# EAGLE design LB1. Expansion Board (EAGLE 9.6.2)
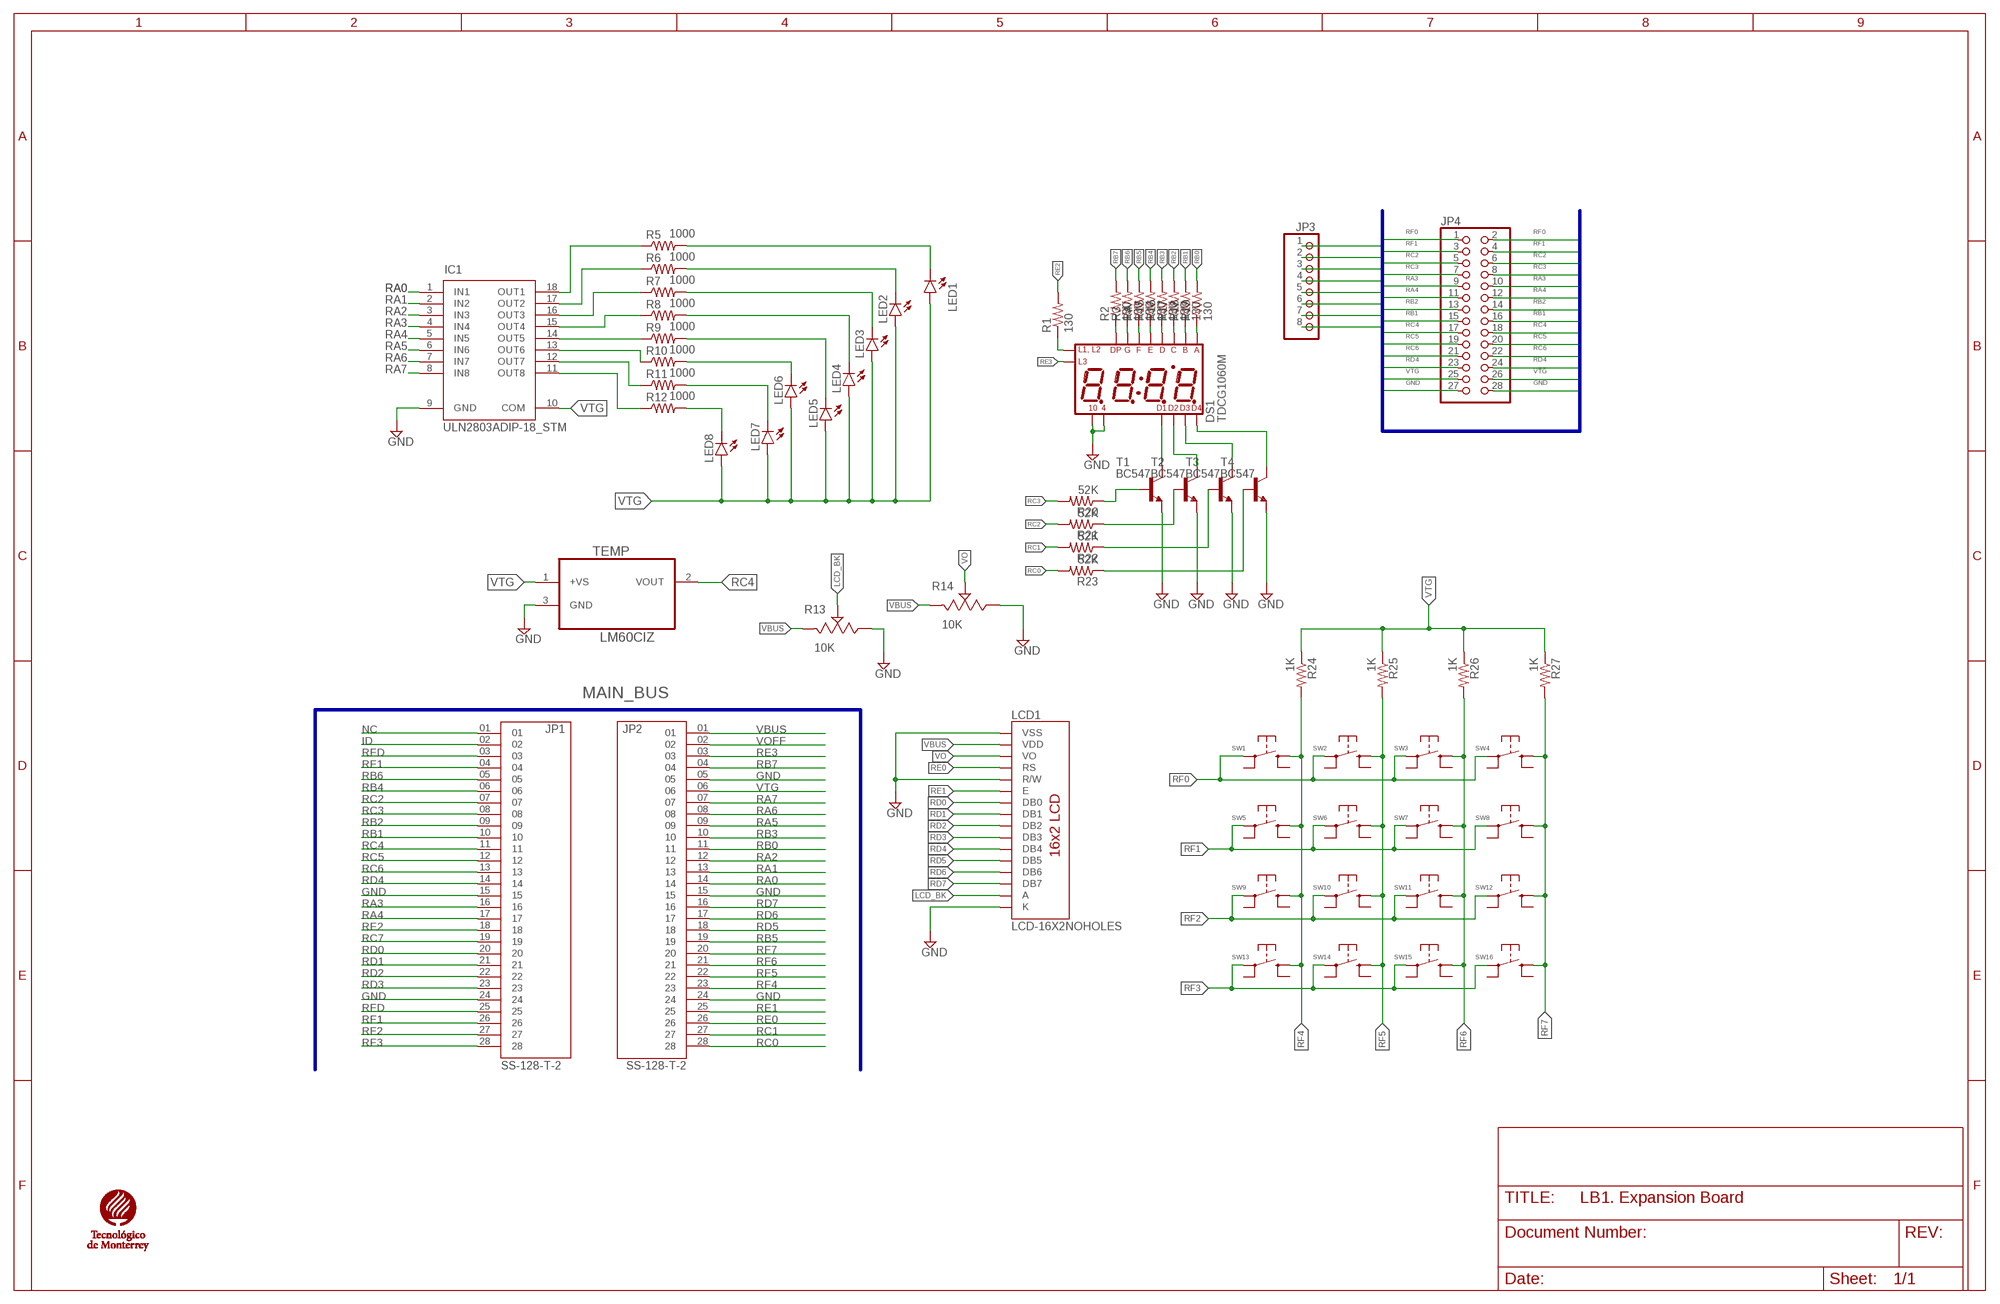
[diagram p0: schematic, sheet 1]

## Parts
DS1  TDCG1060M  [DISPLAY_TDCG1060M]
IC1  ULN2803ADIP-18_STM  [DIP-18_STM]
JP1  SS-128-T-2  [SAMTEC_SS-128-T-2]
JP2  SS-128-T-2  [SAMTEC_SS-128-T-2]
JP3  PINHD-1X8BIG  [1X08-BIG]
JP4  PINHD-2X14-CB  [2X14-BIG]
LCD1  LCD-16X2NOHOLES  [LCD-16X2_NOHOLESNOSILK]
LED1  LED3MM  [LED3MM]
LED2  LED3MM  [LED3MM]
LED3  LED3MM  [LED3MM]
LED4  LED3MM  [LED3MM]
LED5  LED3MM  [LED3MM]
LED6  LED3MM  [LED3MM]
LED7  LED3MM  [LED3MM]
LED8  LED3MM  [LED3MM]
R1  130  R-US  [0207/10]
R2  130  R-US  [0207/10]
R3  130  R-US  [0207/10]
R4  130  R-US  [0207/10]
R5  1000  R-US  [0207/10]
R6  1000  R-US  [0207/10]
R7  1000  R-US  [0207/10]
R8  1000  R-US  [0207/10]
R9  1000  R-US  [0207/10]
R10  1000  R-US  [0207/10]
R11  1000  R-US  [0207/10]
R12  1000  R-US  [0207/10]
R13  10K  3362P-1-103LF  [3362P-1-103LF]
R14  10K  3362P-1-103LF  [3362P-1-103LF]
R15  130  R-US  [0207/10]
R16  130  R-US  [0207/10]
R17  130  R-US  [0207/10]
R18  130  R-US  [0207/10]
R19  130  R-US  [0207/10]
R20  52K  R-US  [0207/10]
R21  52K  R-US  [0207/10]
R22  52K  R-US  [0207/10]
R23  52K  R-US  [0207/10]
R24  1K  R-US  [0207/10]
R25  1K  R-US  [0207/10]
R26  1K  R-US  [0207/10]
R27  1K  R-US  [0207/10]
SW1  1825910-2  [TE_1825910-2]
SW2  1825910-2  [TE_1825910-2]
SW3  1825910-2  [TE_1825910-2]
SW4  1825910-2  [TE_1825910-2]
SW5  1825910-2  [TE_1825910-2]
SW6  1825910-2  [TE_1825910-2]
SW7  1825910-2  [TE_1825910-2]
SW8  1825910-2  [TE_1825910-2]
SW9  1825910-2  [TE_1825910-2]
SW10  1825910-2  [TE_1825910-2]
SW11  1825910-2  [TE_1825910-2]
SW12  1825910-2  [TE_1825910-2]
SW13  1825910-2  [TE_1825910-2]
SW14  1825910-2  [TE_1825910-2]
SW15  1825910-2  [TE_1825910-2]
SW16  1825910-2  [TE_1825910-2]
T1  BC547  [TO92]
T2  BC547  [TO92]
T3  BC547  [TO92]
T4  BC547  [TO92]
TEC1  TEC_LOGO  [TEC_LOGO]
TEMP  LM60CIZ  [TO92/]

## Nets
GND: DS1.4 DS1.10 IC1.9(GND) JP1.15 JP1.24 JP2.05 JP2.15 JP2.24 JP3.1 JP4.27 JP4.28 LCD1.1(VSS) LCD1.5(R/W) LCD1.16(K) R13.3 R14.3 T1.1(E) T2.1(E) T3.1(E) T4.1(E) TEMP.3(GND)
ID: JP1.02
LCD_BK: LCD1.15(A) R13.2
N$1: LED1.K(C) R5.2
N$2: IC1.18(OUT1) R5.1
N$3: IC1.17(OUT2) R6.1
N$4: LED2.K(C) R6.2
N$5: IC1.16(OUT3) R7.1
N$6: IC1.15(OUT4) R8.1
N$7: IC1.14(OUT5) R9.1
N$8: IC1.13(OUT6) R10.1
N$9: IC1.12(OUT7) R11.1
N$10: IC1.11(OUT8) R12.1
N$11: LED3.K(C) R7.2
N$12: LED4.K(C) R8.2
N$13: LED5.K(C) R9.2
N$14: LED6.K(C) R10.2
N$15: LED8.K(C) R12.2
N$16: LED7.K(C) R11.2
N$17: R20.1 T1.2(B)
N$18: LED1.A LED2.A LED3.A LED4.A LED5.A LED6.A LED7.A LED8.A
N$19: DS1.12(L1_L2) R1.1
N$20: DS1.7(DP) R2.1
N$21: DS1.15(G) R3.1
N$22: DS1.11(F) R4.1
N$23: DS1.5(E) R15.1
N$24: DS1.3(D) R16.1
N$25: DS1.13(C) R17.1
N$26: DS1.16(B) R18.1
N$27: DS1.14(A) R19.1
N$28: R21.1 T2.2(B)
N$29: R22.1 T3.2(B)
N$30: R23.1 T4.2(B)
N$31: DS1.1(DIG1) T1.3(C)
N$32: DS1.2(DIG2) T2.3(C)
N$33: DS1.6(DIG3) T3.3(C)
N$34: DS1.8(DIG4) T4.3(C)
NC: JP1.01
RA0: IC1.1(IN1) JP2.14
RA1: IC1.2(IN2) JP2.13
RA2: IC1.3(IN3) JP2.12
RA3: IC1.4(IN4) JP1.16 JP3.2 JP4.9 JP4.10
RA4: IC1.5(IN5) JP1.17 JP3.3 JP4.11 JP4.12
RA5: IC1.6(IN6) JP2.09
RA6: IC1.7(IN7) JP2.08
RA7: IC1.8(IN8) JP2.07
RB0: JP2.11 R19.2
RB1: JP1.10 JP3.4 JP4.15 JP4.16 R18.2
RB2: JP1.09 JP3.5 JP4.13 JP4.14 R17.2
RB3: JP2.10 R16.2
RB4: JP1.06 R15.2
RB5: JP2.19 R4.2
RB6: JP1.05 R3.2
RB7: JP2.04 R2.2
RC0: JP2.28 R23.2
RC1: JP2.27 R22.2
RC2: JP1.07 JP3.6 JP4.5 JP4.6 R21.2
RC3: JP1.08 JP3.7 JP4.7 JP4.8 R20.2
RC4: JP1.11 JP3.8 JP4.17 JP4.18 TEMP.2(VOUT)
RC5: JP1.12 JP4.19 JP4.20
RC6: JP1.13 JP4.21 JP4.22
RC7: JP1.19
RD0: JP1.20 LCD1.7(DB0)
RD1: JP1.21 LCD1.8(DB1)
RD2: JP1.22 LCD1.9(DB2)
RD3: JP1.23 LCD1.10(DB3)
RD4: JP1.14 JP4.23 JP4.24 LCD1.11(DB4)
RD5: JP2.18 LCD1.12(DB5)
RD6: JP2.17 LCD1.13(DB6)
RD7: JP2.16 LCD1.14(DB7)
RE0: JP2.26 LCD1.4(RS)
RE1: JP2.25 LCD1.6(E)
RE2: JP1.18 R1.2
RE3: DS1.9(L3) JP2.03
RF0: JP4.1 JP4.2 SW1.1(P) SW2.1(P) SW3.1(P) SW4.1(P)
RF1: JP1.04 JP1.26 JP4.3 JP4.4 SW5.1(P) SW6.1(P) SW7.1(P) SW8.1(P)
RF2: JP1.27 SW9.1(P) SW10.1(P) SW11.1(P) SW12.1(P)
RF3: JP1.28 SW13.1(P) SW14.1(P) SW15.1(P) SW16.1(P)
RF4: JP2.23 R24.2 SW1.2(S) SW5.2(S) SW9.2(S) SW13.2(S)
RF5: JP2.22 R25.2 SW2.2(S) SW6.2(S) SW10.2(S) SW14.2(S)
RF6: JP2.21 R26.2 SW3.2(S) SW7.2(S) SW11.2(S) SW15.2(S)
RF7: JP2.20 R27.2 SW4.2(S) SW8.2(S) SW12.2(S) SW16.2(S)
RFD: JP1.03 JP1.25
VBUS: JP2.01 LCD1.2(VDD) R13.1 R14.1
VO: LCD1.3(VO) R14.2
VOFF: JP2.02
VTG: IC1.10(COM) JP2.06 JP4.25 JP4.26 R24.1 R25.1 R26.1 R27.1 TEMP.1(+VS)
Unconnected: SW1.3(P1) SW1.4(S1) SW2.3(P1) SW2.4(S1) SW3.3(P1) SW3.4(S1) SW4.3(P1) SW4.4(S1) SW5.3(P1) SW5.4(S1) SW6.3(P1) SW6.4(S1) SW7.3(P1) SW7.4(S1) SW8.3(P1) SW8.4(S1) SW9.3(P1) SW9.4(S1) SW10.3(P1) SW10.4(S1) SW11.3(P1) SW11.4(S1) SW12.3(P1) SW12.4(S1) SW13.3(P1) SW13.4(S1) SW14.3(P1) SW14.4(S1) SW15.3(P1) SW15.4(S1) SW16.3(P1) SW16.4(S1)

## Buses
GND,RA3,RA4,RB1,RB2,RC2,RC3,RC4,RC5,RC6,RD4,RF0,RF1,VTG
MAIN_BUS

## Library data of the parts
DS1 = TE2015_Microcontroladores:TDCG1060M: Clockmodule 10mm Green m.Plex c.c.-E4; DESCRIPTION: Display Modules - LED Character and Numeric Green 7-Segment Clock 4 Character Common Cathode 2V 20mA 0.504 H x 1.583 W x 0.276 D (12.80mm x 40.20mm x 7.00mm) 16-DIP (0.400, 10.16mm); DIGI-KEY_PART_NUMBER: TDCG1060M-ND; MF: Vishay; MP: TDCG1060M; PACKAGE: None; PURCHASE-URL: https://pricing.snapeda.com/search/part/TDCG1060M/?ref=eda
IC1 = TE2015_Microcontroladores:ULN2803A; COPYRIGHT: Copyright (C) 2022 Ultra Librarian. All rights reserved.; DIGI-KEY_PART_NUMBER_1: 497-2356-5-ND; MANUFACTURER_PART_NUMBER: ULN2803A; MFR_NAME: STMicroelectronics
JP1 JP2 = TE2015_Microcontroladores:SS-128-T-2; DESCRIPTION: 28 Position Receptacle Connector 0.100 (2.54mm) Through Hole Gold; DIGI-KEY_PART_NUMBER: SAM1117-28-ND; MF: Samtec; MP: SS-128-T-2; PACKAGE: None; PURCHASE-URL: https://pricing.snapeda.com/search/part/SS-128-T-2/?ref=eda
JP3 = TE2015_Microcontroladores:PINHD-1X8: PIN HEADER
JP4 = TE2015_Microcontroladores:PINHD-2X14: PIN HEADER
LCD1 = TE2015_Microcontroladores:LCD-16X2: Standard text-only 16x2 parallel input LCD Basic 16 character by 2 line display. Typically utilizes the extremely common HD44780 parallel interface chipset SparkFun Products: Basic 16x2 Green <https://www.sparkfun.com/products/255> Basic 8x2 Green <https://www.sparkfun.com/products/11122>; SF_ID: LCD-00255
LED1-LED8 = TE2015_Microcontroladores:LED3MM
R1-R12 R15-R27 = TE2015_Microcontroladores:R-US; SPICEPREFIX: R
R13 R14 = TE2015_Microcontroladores:3362P-1-103LF: TRIMMER 10K OHM 0.5W PC PIN TOP Manufacturer's datasheet <https://www.bourns.com/docs/Product-Datasheets/3362.pdf>; CREATED_PN: PCBLayout.com; DIGIKEY_PN: 3362P-103LF-ND; MANUFACTURER: Bourns Inc.; MPN: 3362P-1-103LF
SW1-SW16 = TE2015_Microcontroladores:1825910-2: SWITCH TACTILE SPST-NO 0.05A 24V Check availability <https://pricing.snapeda.com/parts/1825910-2/TE%20Connectivity/view-part?ref=eda>; AVAILABILITY: In Stock; COMMENT: 1825910-2; CONFIGURATION_POLE-THROW: Single Pole - Single Throw; CONTACT_CURRENT_RATING: 50 mA; DESCRIPTION: 50 mA SPST Round Actuator 160 Gram Force Tactile Pushbutton Switch; EU_ROHS_COMPLIANCE: Compliant; MF: TE Connectivity; MP: 1825910-2; PACKAGE: None; PRICE: None; PURCHASE-URL: https://pricing.snapeda.com/search/part/1825910-2/?ref=eda
T1-T4 = transistor:BC547: NPN TRANSISTOR
TEC1 = TE2015_Microcontroladores:TEC_LOGO
TEMP = TE2015_Microcontroladores:LM60CIZ: IC, TEMPERATURE SENSOR, ± 3°C

## Board
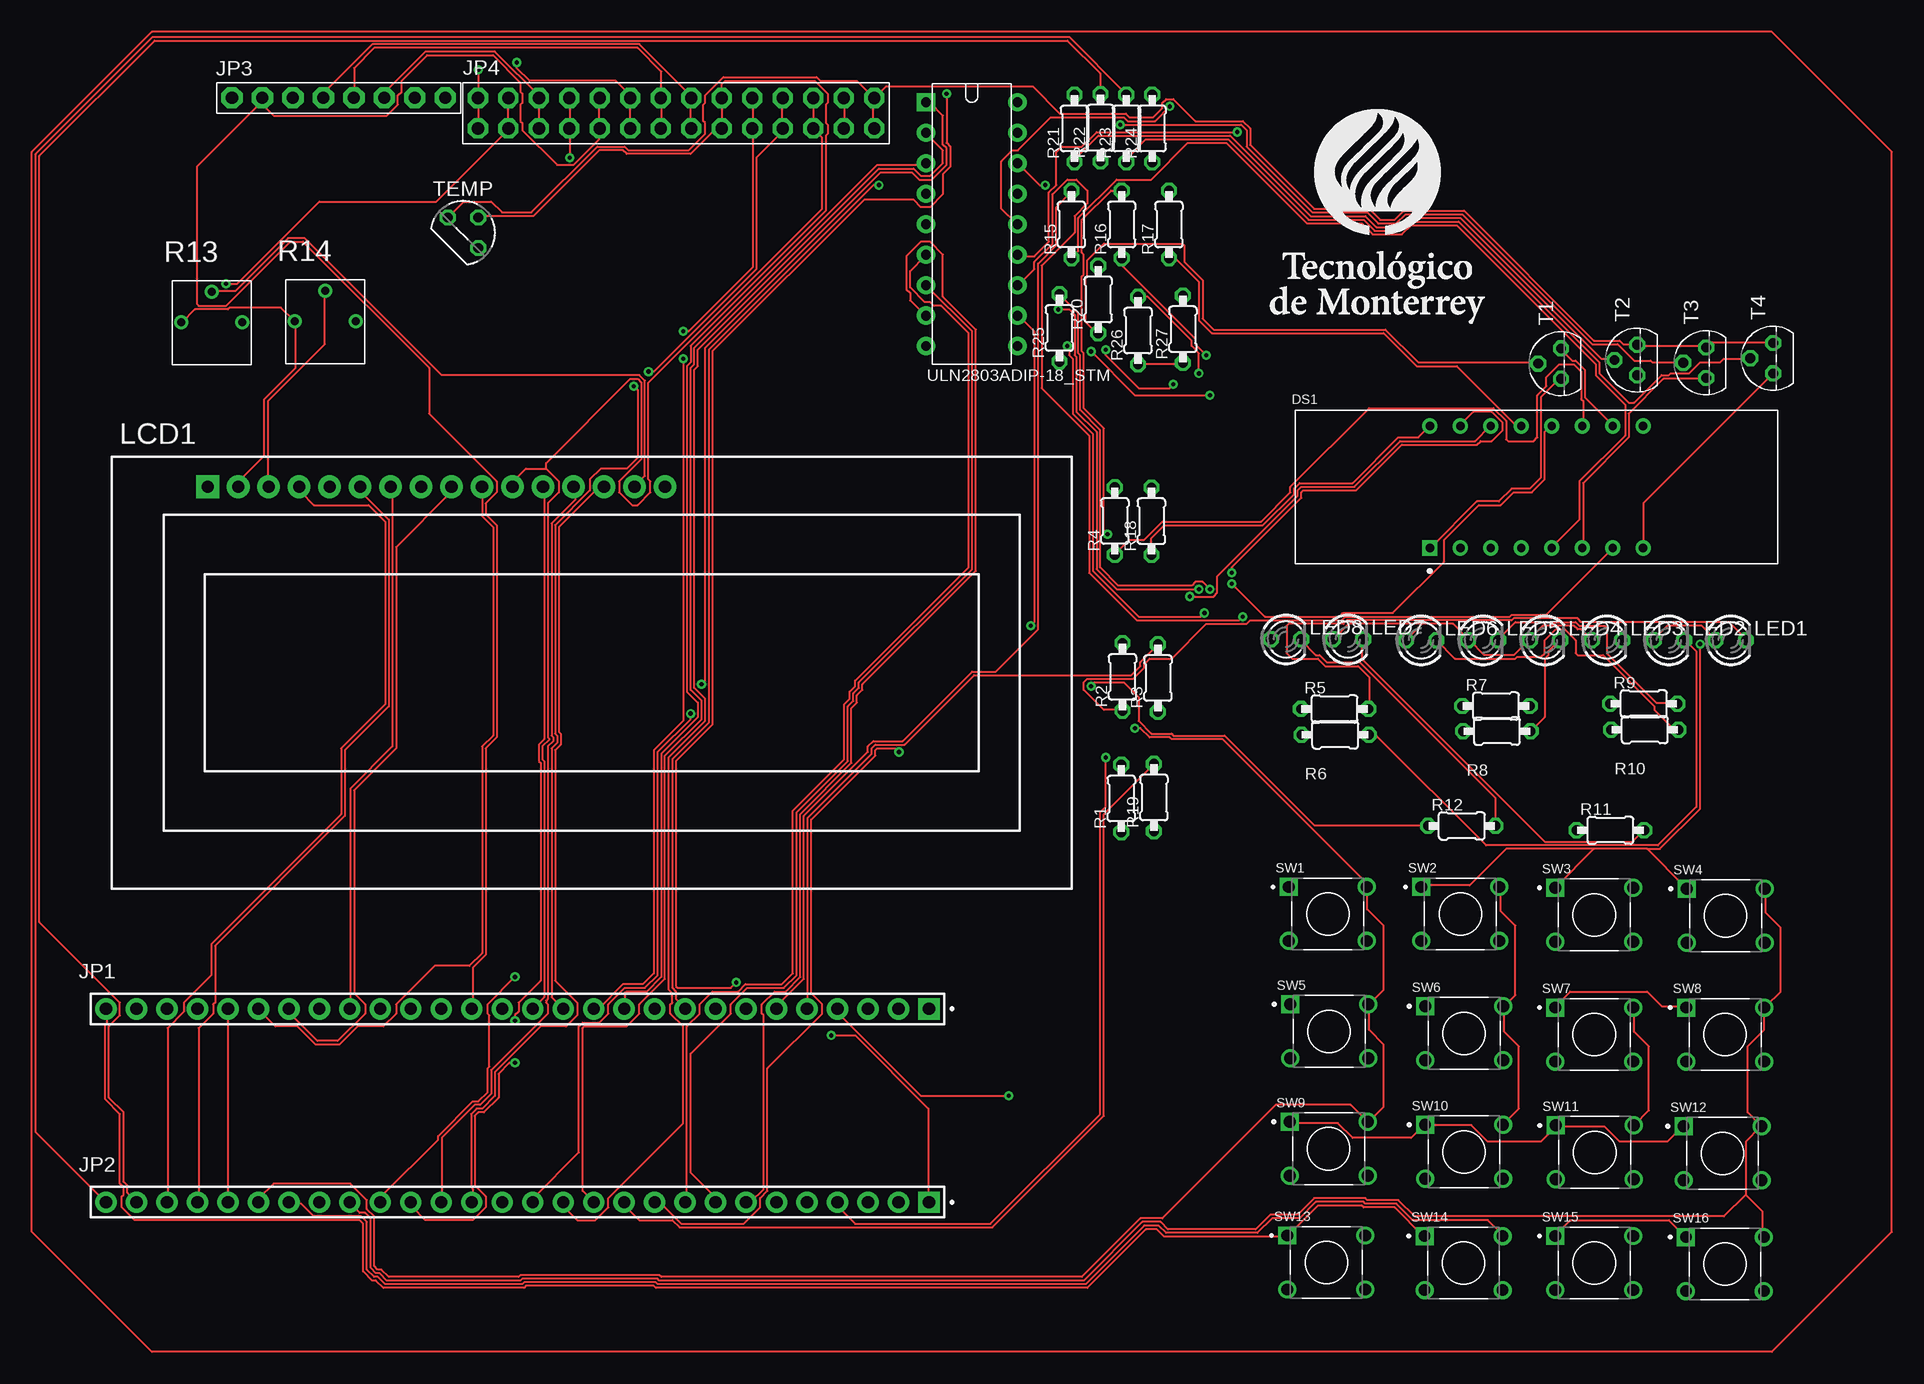
[diagram p1: board, top side]
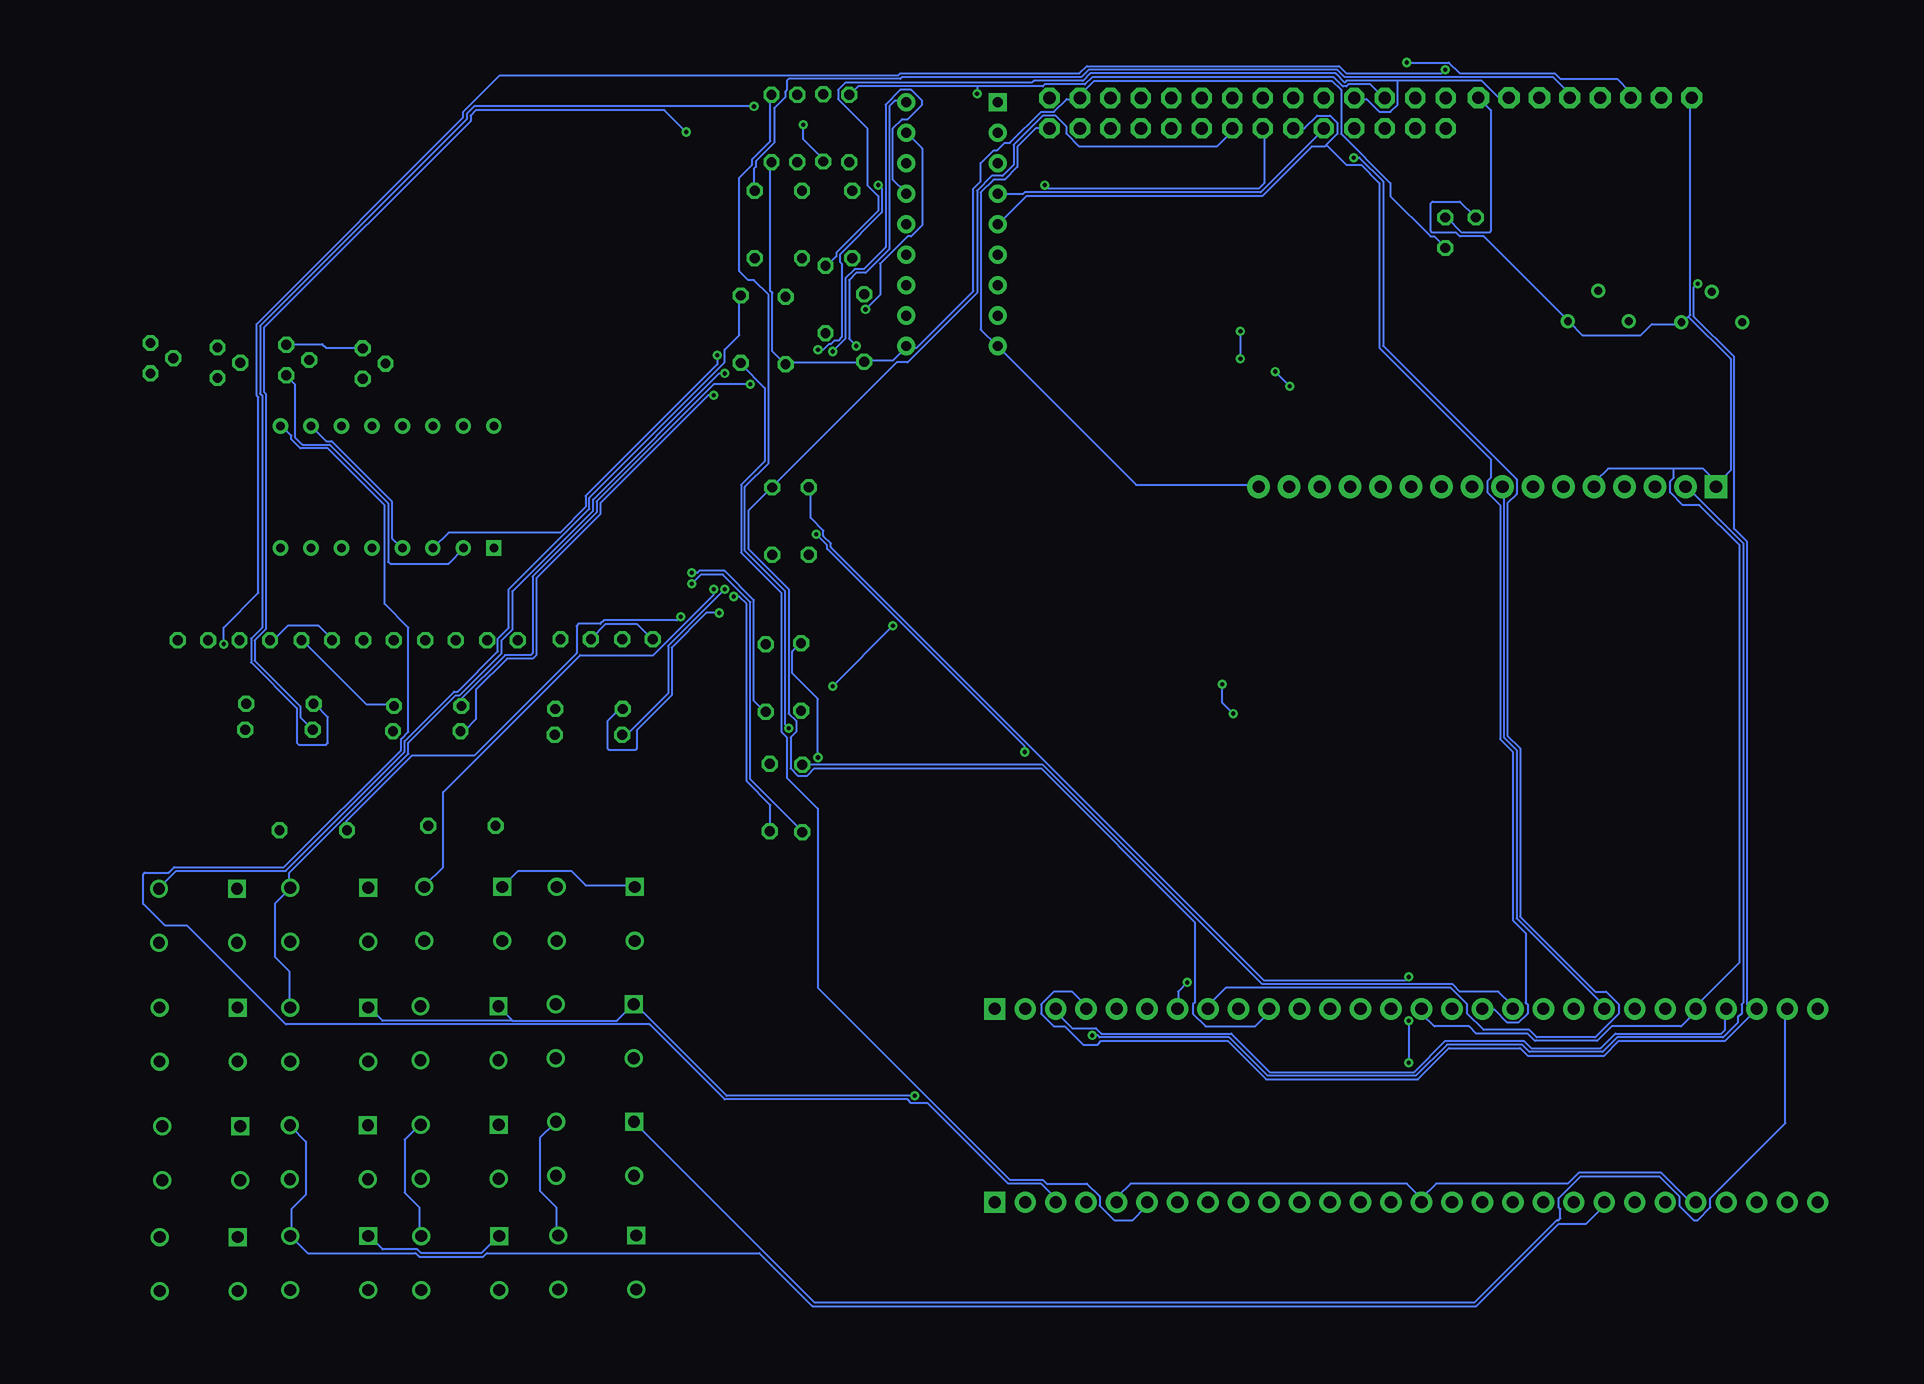
[diagram p2: board, bottom side, seen from below]

No outline drawn. Coordinates in mm, seen from the top.
Copper layers (1*16): Top 0.035mm / dielectric 1.5mm / Bottom 0.035mm
Design rules "default *": minimum track width 6mil, minimum drill 0.35mm, track to track 6mil, track to pad 6mil, pad to pad 6mil, via to via 6mil, smd to smd 6mil, copper to edge 15mil, drill to drill 6mil, minimum pad ring 10mil, minimum via ring 8mil, stop-mask expansion 4mil, vias tented up to drill 0mil, thermal gap 10mil

### Footprints (pad centres in the part's own frame; a part is rotated, then mirrored left to right if it is on the bottom)
DISPLAY_TDCG1060M = drill 0.7 pad 1.27 square: 1 -8.89,-5.08 | drill 0.7 pad 1.27: 2 -6.35,-5.08; 3 -3.81,-5.08; 4 -1.27,-5.08; 5 1.27,-5.08; 6 3.81,-5.08; 7 6.35,-5.08; 8 8.89,-5.08; 9 8.89,5.08; 10 6.35,5.08; 11 3.81,5.08; 12 1.27,5.08; 13 -1.27,5.08; 14 -3.81,5.08; 15 -6.35,5.08; 16 -8.89,5.08
DIP-18_STM = drill 0.813 pad 1.524 square: 1 0,0 | drill 0.813 pad 1.524: 2 0,-2.54; 3 0,-5.08; 4 0,-7.62; 5 0,-10.16; 6 0,-12.7; 7 0,-15.24; 8 0,-17.78; 9 0,-20.32; 10 7.62,-20.32; 11 7.62,-17.78; 12 7.62,-15.24; 13 7.62,-12.7; 14 7.62,-10.16; 15 7.62,-7.62; 16 7.62,-5.08; 17 7.62,-2.54; 18 7.62,0
SAMTEC_SS-128-T-2 = drill 1.016 pad 1.778 square: 01 0,0 | drill 1.016 pad 1.778: 02 -2.54,0; 03 -5.08,0; 04 -7.62,0; 05 -10.16,0; 06 -12.7,0; 07 -15.24,0; 08 -17.78,0; 09 -20.32,0; 10 -22.86,0; 11 -25.4,0; 12 -27.94,0; 13 -30.48,0; 14 -33.02,0; 15 -35.56,0; 16 -38.1,0; 17 -40.64,0; 18 -43.18,0; 19 -45.72,0; 20 -48.26,0; 21 -50.8,0; 22 -53.34,0; 23 -55.88,0; 24 -58.42,0; 25 -60.96,0; 26 -63.5,0; 27 -66.04,0; 28 -68.58,0
1X08-BIG = drill 1.016 pad 1.778 octagon: 1 -8.89,0; 2 -6.35,0; 3 -3.81,0; 4 -1.27,0; 5 1.27,0; 6 3.81,0; 7 6.35,0; 8 8.89,0
2X14-BIG = drill 1.016 pad 1.676 octagon: 1 -16.51,-1.27; 2 -16.51,1.27; 3 -13.97,-1.27; 4 -13.97,1.27; 5 -11.43,-1.27; 6 -11.43,1.27; 7 -8.89,-1.27; 8 -8.89,1.27; 9 -6.35,-1.27; 10 -6.35,1.27; 11 -3.81,-1.27; 12 -3.81,1.27; 13 -1.27,-1.27; 14 -1.27,1.27; 15 1.27,-1.27; 16 1.27,1.27; 17 3.81,-1.27; 18 3.81,1.27; 19 6.35,-1.27; 20 6.35,1.27; 21 8.89,-1.27; 22 8.89,1.27; 23 11.43,-1.27; 24 11.43,1.27; 25 13.97,-1.27; 26 13.97,1.27; 27 16.51,-1.27; 28 16.51,1.27
LCD-16X2_NOHOLESNOSILK = drill 1.016 pad 1.88 square: 1 -32,15.5 | drill 1.016 pad 1.88: 2 -29.46,15.5; 3 -26.92,15.5; 4 -24.38,15.5; 5 -21.84,15.5; 6 -19.3,15.5; 7 -16.76,15.5; 8 -14.22,15.5; 9 -11.68,15.5; 10 -9.14,15.5; 11 -6.6,15.5; 12 -4.06,15.5; 13 -1.52,15.5; 14 1.02,15.5; 15 3.56,15.5; 16 6.1,15.5
LED3MM = drill 0.813 octagon: A -1.27,0; K 1.27,0
0207/10 = drill 0.813 octagon: 1 -1.54,0; 2 4.08,0
3362P-1-103LF = drill 0.66: 1 -2.54,0; 2 0,2.54; 3 2.54,0
TE_1825910-2 = drill 0.99 square: 1 0,0 | drill 0.99: 2 6.5,0; 3 0,-4.5; 4 6.5,-4.5
TO92 = drill 0.813 octagon: 1 1.27,0; 2 0,1.905; 3 -1.27,0
TO92/ = drill 0.813 octagon: 1 1.27,-1.27; 2 1.27,1.27; 3 -1.27,1.27

### Placement (x,y rotation side)
DS1  130.39,72.07 0 top
IC1  79.51,104.13 0 top
JP1  79.76,28.58 0 top
JP2  79.76,12.47 0 top
JP3  30.56,104.5 0 top
JP4  58.69,103.22 0 top
LCD1  51.66,56.59 0 top
LED1  146.58,59.3 0 top
LED2  141.42,59.3 0 top
LED3  136.26,59.3 0 top
LED4  131.1,59.3 0 top
LED5  125.94,59.3 0 top
LED6  120.78,59.3 0 top
LED7  114.68,59.38 0 top
LED8  109.52,59.38 0 top
R1  95.79,44.84 90 top
R2  95.89,54.97 90 top
R3  98.84,54.88 90 top
R4  95.25,67.96 90 top
R5  112.3,53.58 0 top
R6  112.34,51.42 0 top
R7  125.74,53.82 0 top
R8  125.82,51.72 0 top
R9  138.06,54 0 top
R10  138.14,51.84 0 top
R11  135.28,43.46 0 top
R12  122.89,43.83 0 top
R13  19.99,85.8 0 top
R14  29.45,85.88 0 top
R15  91.63,92.68 90 top
R16  95.82,92.68 90 top
R17  99.76,92.68 90 top
R18  98.3,67.95 90 top
R19  98.5,44.92 90 top
R20  93.86,86.42 90 top
R21  91.89,100.68 90 top
R22  94.05,100.73 90 top
R23  96.2,100.68 90 top
R24  98.36,100.68 90 top
R25  90.64,84.05 90 top
R26  97.19,83.83 90 top
R27  100.92,83.95 90 top
SW1  109.75,38.74 0 top
SW2  120.79,38.74 0 top
SW3  131.95,38.66 0 top
SW4  142.9,38.59 0 top
SW5  109.86,28.96 0 top
SW6  121.11,28.79 0 top
SW7  131.95,28.69 0 top
SW8  142.86,28.69 0 top
SW9  109.82,19.17 0 top
SW10  121.1,18.91 0 top
SW11  131.99,18.87 0 top
SW12  142.64,18.79 0 top
SW13  109.63,9.7 0 top
SW14  121.06,9.65 0 top
SW15  131.95,9.65 0 top
SW16  142.85,9.57 0 top
T1  132.43,82.35 90 top
T2  138.79,82.65 90 top
T3  144.53,82.42 90 top
T4  150.11,82.8 90 top
TEC1  106.98,84.45 0 top
TEMP  40.94,93.26 0 top

### Tracks (layer width: path | path; a pad name or v marks a point on that pad's centre or on a via)
GND
  Top 0.152: T4.1 150.11,84.12 144.93,84.12 144.63,83.82 T3.1 144.47,83.82 138.84,83.82 T2.1 138.68,83.97 137.62,83.97 137.31,84.28 135.18,84.28 124.36,95.1 119.33,95.1 118.57,94.34 117.35,94.34 116.43,95.25 111.86,95.25 106.53,100.58 106.53,101.96 105.92,102.56 101.96,102.56 100.13,104.39 99.52,104.39 99.21,104.09 99.21,103.63 98.45,102.87 96.47,102.87 96.16,103.17 90.68,103.17 88.39,105.46 76.2,105.46 75.29,104.55 JP4.28 | DS1.10 136.7,77.27 134.42,79.55 134.42,81.84 133.66,82.6 133.35,82.6 132.44,83.52 T1.1 | JP4.28 75.13,104.39 75.13,101.96 JP4.27 | JP2.24 21.34,12.5 21.34,28.5 JP1.24 | JP4.28 75.13,104.55 73.76,105.92 70.71,105.92 70.41,106.22 62.64,106.22 61.11,104.7 61.11,104.09 60.96,103.94 60.96,102.56 61.11,102.41 61.11,101.5 59.74,100.13 54.71,100.13 54.41,100.43 52.12,100.43 46.63,94.94 44.2,94.94 43.28,95.86 41,95.86 39.78,94.64 TEMP.3
  Bottom 0.152: DS1.4 129.24,67.06 130,67.82 130,70.87 135.03,75.89 135.48,75.89 136.7,77.11 DS1.10 | T1.1 132.44,83.67 135.48,83.67 135.79,83.97 138.68,83.97 T2.1 | JP4.27 75.29,101.96 76.35,101.96 77.88,100.43 77.88,98.75 78.94,97.69 79.86,97.69 80.92,96.62 80.92,85.19 79.55,83.82 IC1.9 79.4,83.67 67.97,72.24 57.91,72.24 LCD1.16 | TEMP.3 39.78,94.64 41,95.86 43.28,95.86 43.43,95.71 43.43,93.42 43.28,93.27 41.3,93.27 41,92.96 39.01,92.96 32,85.95 R14.3 31.85,85.8 30.79,84.73 25.91,84.73 24.99,85.65 22.55,85.65 R13.3 22.4,85.8 21.95,86.26 | 21.95,86.26 21.79,86.41 21.79,104.39 JP3.1 | 19.51,72.39 18.44,73.46 18.44,82.75 21.95,86.26 | 19.51,72.39 19.66,72.24 LCD1.1 19.51,72.39 | 23.16,73.61 20.73,73.61 19.51,72.39 | 23.16,73.61 28.65,73.61 29.72,72.54 29.72,72.24 LCD1.5 | 44.2,12.8 44.2,12.5 JP2.15 44.2,12.8 | 44.2,12.8 42.98,14.02 32,14.02 31.09,14.94 24.23,14.94 21.79,12.5 21.49,12.5 JP2.24 | JP1.15 44.2,28.5 44.2,28.19 43.13,27.13 40.23,27.13 39.62,26.52 35.36,26.52 34.75,25.91 29.57,25.91 28.35,27.13 22.55,27.13 21.49,28.19 21.49,28.5 JP1.24 21.49,28.65 17.68,32.46 17.68,67.21 21.03,70.56 22.4,70.56 23.47,71.63 23.47,72.54 23.16,72.85 23.16,73.61 | 44.2,12.8 45.41,14.02 68.43,14.02 69.49,12.95 69.49,12.5 JP2.05
LCD_BK
  Top 0.152: R13.2 20.12,88.39 21.95,88.39 26.36,92.81 27.74,92.81 39.17,81.38 55.63,81.38 56.08,80.92 56.08,73 55.32,72.24 LCD1.15
N$1
  Top 0.152: R5.2 116.43,53.65 116.43,56.24 115.52,57.15 112.78,57.15 112.17,57.76 110.03,57.76 109.58,58.22 109.58,60.5 109.73,60.66 114.3,60.66 114.61,60.96 128.32,60.96 128.47,61.11 133.81,61.11 134.11,60.81 146.46,60.81 147.83,59.44 LED1.K
N$2  (via drill 0.35)
  Top 0.152: v102.72,61.57 102.41,61.27 97.23,61.27 93.42,65.08 93.42,76.5 91.75,78.18 91.75,82.75 91.44,83.06 91.44,83.67 v91.29,83.82
  Bottom 0.152: v102.72,61.57 103.78,61.57 106.68,58.67 106.68,54.71 109.58,51.82 109.58,50.29 109.73,50.14 111.86,50.14 112.01,50.29 112.01,52.58 111.1,53.49 110.8,53.49 R5.1 | v91.29,83.82 91.9,84.43 91.9,89.31 91.29,89.92 90.53,89.92 88.54,91.9 88.54,103.78 88.09,104.24 87.17,104.24 IC1.18
N$3  (via drill 0.35)
  Top 0.152: v102.26,63.55 95.4,63.55 93.73,65.23 93.73,76.66 92.05,78.33 92.05,82.91 91.9,83.06 91.9,86.41 91.44,86.87 v90.53,86.87
  Bottom 0.152: v102.26,63.55 106.98,58.83 106.98,54.86 110.34,51.51 110.8,51.51 R6.1 | v90.53,86.87 89.31,88.09 89.31,90.68 87.02,92.96 86.72,92.96 85.8,93.88 85.8,100.28 87.02,101.5 IC1.17
N$4
  Top 0.152: R6.2 116.43,51.36 117.04,51.36 126.19,42.22 140.51,42.22 143.71,45.41 143.71,58.37 142.8,59.28 LED2.K
N$5  (via drill 0.35)
  Top 0.152: v100.13,80.62 99.82,80.31 97.23,80.31 94.49,83.06 v94.49,83.52 | v89.46,97.23 89,97.23 87.17,99.06 IC1.16
  Bottom 0.152: v100.13,80.62 103.17,80.62 112.93,70.87 112.93,69.95 118.26,64.62 118.26,58.22 118.42,58.06 120.55,58.06 124.21,54.41 124.21,53.95 R7.1 | v94.49,83.52 94.03,83.52 93.57,83.97 93.42,83.97 93.12,84.28 92.81,84.28 92.51,84.58 92.51,90.68 92.66,90.83 92.66,91.44 89.15,94.94 89.15,96.93 v89.46,97.23
N$6  (via drill 0.35)
  Top 0.152: v103.17,79.7 96.93,79.7 v93.27,83.36
  Bottom 0.152: v103.17,79.7 103.63,79.7 112.62,70.71 112.62,69.8 117.96,64.47 117.96,58.06 118.26,57.76 120.4,57.76 122.99,55.17 122.99,52.73 123.9,51.82 124.21,51.82 R8.1 | v93.27,83.36 92.2,84.43 92.2,89.46 91.44,90.22 90.68,90.22 88.85,92.05 88.85,103.94 87.63,105.16 86.72,105.16 85.8,104.24 85.8,103.94 87.02,102.72 87.48,102.72 88.24,101.96 88.24,97.69 87.17,96.62 IC1.15
N$7  (via drill 0.35)
  Top 0.152: v99.82,103.78 98.6,102.56 96.32,102.56 96.01,102.87 89.92,102.87 87.17,100.13 86.72,100.13 85.8,99.21 85.8,95.25 87.02,94.03 IC1.14
  Bottom 0.152: v99.82,103.78 123.14,103.78 123.75,103.17 123.75,102.72 140.97,85.5 140.97,79.86 140.82,79.7 140.82,60.35 141.73,59.44 141.73,57.45 137.92,53.65 137.92,50.75 137.77,50.6 135.48,50.6 135.33,50.75 135.33,52.88 136.4,53.95 R9.1
N$8  (via drill 0.35)
  Top 0.152: v105.46,101.65 93.73,101.65 92.51,100.43 90.83,100.43 90.37,99.97 90.37,97.23 89.76,96.62 89.76,92.51 88.54,91.29 87.17,91.29 IC1.13
  Bottom 0.152: v105.46,101.65 107.29,103.48 122.99,103.48 123.44,103.02 123.44,102.56 140.66,85.34 140.66,80.01 140.51,79.86 140.51,60.2 141.43,59.28 141.43,57.61 137.62,53.8 137.62,52.88 136.7,51.97 R10.1
N$9  (via drill 0.35)
  Top 0.152: v105.92,61.27 105.61,60.96 97.08,60.96 93.12,64.92 93.12,76.35 89.15,80.31 89.15,90.53 91.9,93.27 91.9,94.64 92.96,95.71 92.96,96.77 92.05,97.69 91.29,97.69 90.07,96.47 90.07,92.35 88.54,90.83 88.54,90.22 87.17,88.85 IC1.12
  Bottom 0.152: v105.92,61.27 106.22,60.96 112.32,60.96 112.62,60.66 114.45,60.66 114.61,60.5 114.61,58.22 123.14,49.68 128.32,49.68 133.81,44.2 133.81,43.59 R11.1
N$10  (via drill 0.35)
  Top 0.152: v93.27,55.47 93.57,55.78 96.01,55.78 97.23,54.56 97.23,52.58 98.3,51.51 99.97,51.51 100.13,51.36 104.39,51.36 111.86,43.89 121.31,43.89 R12.1 | v88.24,60.5 88.54,60.81 88.54,85.04 87.17,86.41 IC1.11
  Bottom 0.152: v88.24,60.5 v93.27,55.47
N$11
  Bottom 0.152: R7.2 129.84,53.95 132.13,53.95 137.47,59.28 LED3.K
N$12
  Top 0.152: R8.2 130,51.82 131.06,52.88 131.06,57.76 131.37,58.06 131.37,58.37 132.28,59.28 LED4.K
N$13
  Top 0.152: R9.2 142.04,54.1 140.36,54.1 136.25,58.22 136.25,60.35 136.09,60.5 133.96,60.5 133.66,60.81 128.63,60.81 127.25,59.44 LED5.K
N$14
  Top 0.152: R10.2 142.19,51.97 141.73,51.97 140.21,53.49 140.21,53.8 135.94,58.06 133.81,58.06 133.66,58.22 133.66,59.28 132.74,60.2 131.98,60.2 131.06,59.28 131.06,58.22 130.76,57.91 128.78,57.91 128.63,57.76 123.6,57.76 122.07,59.28 LED6.K
N$15
  Top 0.152: R12.2 126.95,43.89 126.95,46.18 115.67,57.45 112.93,57.45 112.32,58.06 112.01,58.06 110.8,59.28 LED8.K
N$16
  Top 0.152: R11.2 139.29,43.43 138.38,42.52 131.06,42.52 115.82,57.76 115.82,59.28 LED7.K
N$17
  Top 0.152: T1.2 130.45,82.45 120.55,82.45 117.81,85.19 103.48,85.19 102.56,86.11 102.56,89.31 101.04,90.83 101.04,92.2 100.89,92.35 94.34,92.35 92.96,90.98 92.96,89.61 92.81,89.46 92.81,85.8 93.73,84.89 R20.1
N$18
  Top 0.152: LED2.A 140.21,59.44 141.28,60.5 144.17,60.5 145.24,59.44 LED1.A | 120.85,60.66 119.63,59.44 LED6.A | 120.85,60.66 123.44,60.66 124.66,59.44 LED5.A 124.82,59.28 126.03,58.06 128.47,58.06 129.69,59.28 LED4.A 129.84,59.44 130.91,60.5 133.5,60.5 133.81,60.2 134.11,60.2 134.87,59.44 LED3.A | 120.85,60.66 114.76,60.66 113.54,59.44 LED7.A
  Bottom 0.152: LED8.A 108.36,59.44 109.58,60.66 112.17,60.66 113.39,59.44 LED7.A | LED2.A 140.06,59.44 139.75,59.44 138.68,60.5 136.09,60.5 135.03,59.44 LED3.A
N$19  (via drill 0.35)
  Top 0.152: v105,64.01 107.75,61.27 114,61.27 114.3,61.57 118.42,61.57 122.68,65.84 122.68,67.67 125.58,70.56 127.41,70.56 128.47,71.63 130,71.63 131.06,72.69 131.06,76.66 131.52,77.11 DS1.12
  Bottom 0.152: v105,64.01 104.24,64.77 102.41,64.77 100.13,62.48 100.13,47.7 95.86,43.43 R1.1
N$20
  Top 0.152: DS1.7 136.7,66.9 131.22,61.42 128.32,61.42 128.17,61.27 114.45,61.27 114.15,60.96 106.53,60.96 106.22,60.66 102.87,60.66 99.97,57.76 98.15,57.76 97.69,57.3 97.69,57 96.77,56.08 92.96,56.08 92.66,55.78 92.66,55.17 94.34,53.49 95.86,53.49 R2.1
N$21  (via drill 0.35)
  Top 0.152: v105,64.92 105,65.38 110.8,71.17 110.8,71.63 110.95,71.78 115.37,71.78 119.18,75.59 125.42,75.59 125.73,75.89 126.64,75.89 127.56,76.81 127.56,77.42 126.64,78.33 125.12,78.33 124.05,77.27 DS1.15
  Bottom 0.152: v105,64.92 104.55,64.92 104.39,65.08 102.26,65.08 99.82,62.64 99.82,54.25 98.91,53.34 R3.1
N$22
  Top 0.152: DS1.11 134.26,77.27 134.26,79.25 134.11,79.4 134.11,81.69 133.5,82.3 132.28,82.3 131.22,81.23 131.22,80.47 130.45,79.7 130.45,76.2 130.15,75.89 128.02,75.89 127.86,76.05 127.86,77.57 126.8,78.64 116.43,78.64 109.88,72.08 109.88,71.63 107.44,69.19 99.21,69.19 97.69,67.67 96.47,67.67 95.25,66.45 R4.1
N$23
  Top 0.152: DS1.5 131.67,67.06 133.96,69.34 133.96,72.54 137.77,76.35 137.77,78.94 135.33,81.38 135.33,82.3 123.75,93.88 119.94,93.88 119.18,93.12 116.74,93.12 115.82,94.03 111.25,94.03 104.55,100.74 101.35,100.74 98.3,97.69 95.4,97.69 92.2,94.49 92.2,91.75 91.75,91.29 R15.1
N$24  (via drill 0.35)
  Top 0.152: v102.87,83.06 101.96,83.97 101.96,84.43 95.86,90.53 95.86,91.14 R16.1
  Bottom 0.152: v102.87,83.06 102.87,82.3 113.84,71.32 113.84,70.41 115.98,68.28 125.27,68.28 126.49,67.06 DS1.3
N$25
  Top 0.152: DS1.13 129.08,77.27 128.63,77.27 123.75,82.14 120.4,82.14 117.65,84.89 103.33,84.89 102.26,85.95 102.26,89.15 100.28,91.14 99.82,91.14 R17.1
N$26
  Top 0.152: DS1.16 121.46,77.11 120.55,76.2 118.87,76.2 115.06,72.39 110.64,72.39 110.19,71.93 110.19,71.48 107.59,68.89 99.36,68.89 98.3,67.82 98.3,66.45 R18.1
N$27  (via drill 0.35)
  Top 0.152: v101.5,62.94 103.48,62.94 103.78,63.25 103.78,64.62 110.49,71.32 110.49,71.78 110.8,72.08 115.21,72.08 119.02,75.89 125.27,75.89 126.49,77.11 DS1.14
  Bottom 0.152: v101.5,62.94 101.04,62.94 100.43,62.33 100.43,47.55 98.45,45.57 98.45,43.43 R19.1
N$28
  Top 0.152: T2.2 136.85,82.75 135.79,82.75 124.05,94.49 119.63,94.49 118.87,93.73 117.04,93.73 116.13,94.64 111.56,94.64 104.85,101.35 93.88,101.35 91.75,99.21 R21.1
N$29  (via drill 0.35)
  Top 0.152: v95.71,102.26 105.77,102.26 106.22,101.8 106.22,100.43 111.71,94.94 116.28,94.94 117.2,94.03 118.72,94.03 119.48,94.79 124.21,94.79 135.03,83.97 137.16,83.97 138.53,82.6 139.9,82.6 140.06,82.45 142.49,82.45 T3.2
  Bottom 0.152: v95.71,102.26 95.71,101.04 94.18,99.52 94.18,99.21 R22.1
N$30
  Top 0.152: T4.2 148.13,82.75 146,82.75 145.69,82.45 144.02,82.45 143.1,81.53 141.58,81.53 141.43,81.38 140.82,81.38 138.53,79.1 138.07,79.1 135.64,81.53 135.64,82.45 123.9,94.18 119.79,94.18 119.02,93.42 116.89,93.42 115.98,94.34 111.4,94.34 104.7,101.04 97.84,101.04 96.32,99.52 96.32,99.21 R23.1
N$31
  Top 0.152: DS1.1 121.61,67.06 125.42,70.87 127.25,70.87 128.32,71.93 129.84,71.93 130.76,72.85 130.76,79.55 132.28,81.08 T1.3
N$32
  Bottom 0.152: DS1.2 124.05,66.9 125.27,65.68 130.15,65.68 130.3,65.84 130.3,70.71 135.18,75.59 137.47,75.59 138.07,76.2 138.07,80.62 138.68,81.23 T2.3
N$33
  Top 0.152: DS1.6 134.26,67.06 134.26,72.39 138.07,76.2 138.07,78.18 140.97,81.08 144.47,81.08 T3.3
N$34
  Top 0.152: T4.3 139.29,70.71 139.29,67.06 DS1.8
N$35
  Top 0.152: 15,0 5,10 5,100 15,110 150,110 160,100 160,10 150,0 15,0
RA0  (via drill 0.35)
  Top 0.152: v60.81,55.63 61.11,55.93 61.11,83.67 75.74,98.3 78.33,98.3 78.94,97.69 80.01,97.69 81.23,98.91 81.23,100.28 80.92,100.58 80.92,103.02 79.86,104.09 79.55,104.09 IC1.1 | v59.89,53.19 59.89,52.73 57.15,49.99 57.15,31.39 56.08,30.33 54.41,30.33 53.03,28.96 53.03,28.19 52.27,27.43 50.9,27.43 50.6,27.13 50.6,16.61 46.79,12.8 46.79,12.5 JP2.14
  Bottom 0.152: v60.81,55.63 60.81,54.1 v59.89,53.19
RA1
  Top 0.152: IC1.2 79.55,101.5 80.92,100.13 80.92,99.06 79.86,97.99 79.1,97.99 78.49,98.6 75.59,98.6 60.5,83.52 60.5,82.14 60.2,81.84 60.2,55.32 61.11,54.41 61.11,52.58 58.06,49.53 58.06,30.18 58.37,29.87 58.37,29.11 58.22,28.96 58.22,28.19 59.28,27.13 59.28,19.05 53.03,12.8 53.03,12.04 51.97,10.97 50.44,10.97 49.38,12.04 49.38,12.34 JP2.13
RA2
  Top 0.152: IC1.3 79.4,98.91 75.44,98.91 60.2,83.67 60.2,82.3 59.89,81.99 59.89,55.17 60.81,54.25 60.81,52.73 57.76,49.68 57.76,31.09 55.63,28.96 55.63,28.19 54.56,27.13 51.05,27.13 50.9,26.98 50.9,13.41 51.82,12.5 JP2.12
RA3
  Top 0.152: JP4.10 52.27,104.39 52.27,101.96 JP4.9 52.27,101.8 52.27,101.04 50.14,98.91 48.77,98.91 45.87,101.8 45.87,102.41 45.72,102.56 45.72,103.94 45.87,104.09 45.87,104.85 45.72,105 45.72,105.77 43.43,108.05 37.95,108.05 35.81,105.92 35.81,105 35.51,104.7 35.51,103.94 34.59,103.02 25.15,103.02 24.08,104.09 | 24.08,104.09 18.75,98.75 18.75,87.33 18.9,87.17 21.18,87.17 26.52,92.51 27.58,92.51 38.1,81.99 38.1,78.18 43.74,72.54 43.74,71.63 42.82,70.71 42.82,69.8 43.74,68.89 43.74,51.21 42.82,50.29 42.82,33.07 41.76,32 41.76,28.65 JP1.16 | 24.08,104.09 24.08,104.39 JP3.2 24.08,104.09
  Bottom 0.152: IC1.4 79.4,96.47 77.42,96.47 77.27,96.62 57.61,96.62 52.43,101.8 JP4.9
RA4  (via drill 0.35)
  Top 0.152: JP4.11 54.86,101.96 54.86,104.39 JP4.12 55.02,104.55 53.65,105.92 46.48,105.92 45.41,106.98 v45.41,107.44
  Bottom 0.152: 52.12,100.58 51.21,101.5 51.21,102.41 51.82,103.02 52.88,103.02 53.95,101.96 54.86,101.96 JP4.11 | 52.12,100.58 52.27,100.43 53.34,100.43 57.45,96.32 77.11,96.32 79.4,94.03 IC1.5 | 52.12,100.58 50.44,98.91 49.23,98.91 47.7,97.38 47.7,83.67 38.41,74.37 38.41,72.85 38.71,72.54 38.71,71.63 37.64,70.56 37.64,51.05 36.58,49.99 36.58,35.97 35.51,34.9 35.51,29.11 35.36,28.96 35.36,28.19 36.12,27.43 37.03,27.43 38.1,28.5 39.01,28.5 JP1.17 | v45.41,107.44 41.91,107.44 41,106.53 33.07,106.53 32.61,106.07 27.89,106.07 26.82,105 26.82,104.55 JP3.3
RA5
  Top 0.152: IC1.6 79.4,91.29 78.18,90.07 78.18,88.7 79.4,87.48 79.86,87.48 80.16,87.17 80.77,87.17 83.06,84.89 83.06,65.38 73.61,55.93 73.61,55.47 73.15,55.02 73.15,54.41 72.69,53.95 72.69,49.38 68.43,45.11 68.43,31.55 67.51,30.63 64.47,30.63 63.86,30.02 61.72,30.02 60.66,28.96 60.66,28.19 59.59,27.13 59.59,12.5 JP2.09
RA6
  Top 0.152: IC1.7 79.55,88.85 83.36,85.04 83.36,65.23 73.91,55.78 73.91,55.32 73.46,54.86 73.46,54.25 73,53.8 73,49.23 68.73,44.96 68.73,31.39 67.67,30.33 64.62,30.33 63.25,28.96 63.25,28.19 59.89,24.84 59.89,14.94 61.87,12.95 61.87,12.5 JP2.08
RA7
  Top 0.152: IC1.8 79.4,86.41 78.18,87.63 78.18,88.24 77.88,88.54 77.88,91.29 79.1,92.51 79.86,92.51 80.92,91.44 80.92,87.94 83.67,85.19 83.67,65.08 74.22,55.63 74.22,55.17 73.76,54.71 73.76,54.1 73.3,53.65 73.3,49.07 69.04,44.81 69.04,31.24 67.82,30.02 66.9,30.02 65.84,28.96 65.84,28.19 65.99,28.04 65.99,13.56 64.92,12.5 64.62,12.5 JP2.07
RB0
  Top 0.152: R19.2 98.45,48.92 94.34,44.81 94.34,19.66 85.04,10.36 58.98,10.36 58.37,10.97 55.63,10.97 54.25,12.34 JP2.11
RB1
  Top 0.152: JP4.15 59.89,101.96 59.89,104.39 JP4.16 60.05,104.55 55.63,108.97 33.38,108.97 29.41,105 29.41,104.55 JP3.4
  Bottom 0.152: JP4.15 59.89,101.8 61.27,100.43 72.69,100.43 73.76,101.5 73.76,102.11 74.68,103.02 75.74,103.02 78.18,100.58 78.18,98.91 79.1,97.99 80.01,97.99 81.23,96.77 81.23,88.24 87.02,82.45 87.94,82.45 98.3,72.08 R18.2 98.45,71.93 100.28,70.1 100.28,66.9 96.93,63.55 96.93,53.19 96.32,52.58 96.32,51.66 96.77,51.21 96.77,48.62 96.16,48.01 95.4,48.01 94.79,48.62 75.89,48.62 63.09,35.81 63.09,29.11 63.25,28.96 63.25,28.19 62.18,27.13 58.06,27.13 57,28.19 57,28.5 JP1.10
RB2  (via drill 0.35)
  Top 0.152: JP4.13 57.45,101.96 57.45,104.39 JP4.14 57.45,104.55 57.45,106.68 55.47,108.66 33.53,108.66 31.85,106.98 31.85,104.55 JP3.5 | v75.59,97.23 75.13,97.23 61.42,83.52 61.42,52.43 58.37,49.38 58.37,30.33 58.67,30.02 58.67,29.41 59.44,28.65 JP1.09
  Bottom 0.152: R17.2 99.82,96.77 99.82,98.6 99.67,98.75 99.67,99.21 98.15,100.74 98.15,103.63 97.23,104.55 97.23,105 97.08,105.16 97.08,105.92 96.93,106.07 87.63,106.07 87.48,106.22 72.54,106.22 71.93,106.83 51.21,106.83 50.6,106.22 33.22,106.22 31.85,104.85 31.85,104.55 JP3.5 | v75.59,97.23 75.29,96.93 57.76,96.93 57.3,97.38 57.3,101.8 JP4.13
RB3  (via drill 0.35)
  Top 0.152: v94.64,68.12 94.34,68.43 94.34,76.96 92.66,78.64 92.66,83.21 92.51,83.36 92.51,89.61 92.66,89.76 92.66,91.44 92.51,91.59 92.51,94.34 94.94,96.77 95.71,96.77 R16.2 | v77.27,49.99 76.96,50.29 75.44,50.29 75.29,50.14 75.29,49.68 69.95,44.35 69.95,29.87 70.87,28.96 70.87,28.19 66.29,23.62 66.29,13.41 65.68,12.8 65.68,12.04 64.31,10.67 59.13,10.67 57.45,12.34 57,12.34 JP2.10
  Bottom 0.152: v94.64,68.12 93.73,67.21 93.73,66.9 77.27,50.44 v77.27,49.99
RB4
  Top 0.152: R15.2 91.59,96.62 90.37,95.4 90.37,92.2 88.85,90.68 88.85,60.2 85.34,56.69 83.36,56.69 77.57,50.9 75.13,50.9 74.68,50.44 74.68,49.99 69.34,44.65 69.34,31.09 67.21,28.96 67.21,28.65 JP1.06
RB5  (via drill 0.35)
  Top 0.152: v45.26,31.24 42.98,28.96 42.98,28.19 43.13,28.04 43.13,23.77 42.98,23.62 42.98,21.64 42.22,20.88 41.76,20.88 38.86,17.98 38.86,17.68 34.14,12.95 34.14,12.5 JP2.19
  Bottom 0.152: v45.26,31.24 45.57,30.94 57.3,30.94 93.42,67.06 93.42,67.36 94.03,67.97 94.03,68.43 95.1,69.49 95.1,71.93 R4.2
RB6
  Top 0.152: R3.2 98.75,58.83 97.38,57.45 97.38,57.15 96.62,56.39 83.52,56.39 77.72,50.6 75.29,50.6 74.98,50.29 74.98,49.84 69.65,44.5 69.65,28.65 JP1.05
RB7  (via drill 0.35)
  Top 0.152: v94.49,49.53 94.49,45.41 94.03,44.96 94.03,19.81 84.89,10.67 73.61,10.67 72.24,12.04 72.24,12.34 JP2.04
  Bottom 0.152: v94.49,49.53 94.49,54.41 96.62,56.54 96.62,58.37 96.01,58.98 R2.2
RC0
  Top 0.152: R23.2 96.16,104.85 91.44,109.58 15.09,109.58 5.33,99.82 5.33,18.29 11.12,12.5 JP2.28
RC1
  Top 0.152: R22.2 94.03,104.85 94.03,106.53 91.29,109.27 15.24,109.27 5.64,99.67 5.64,35.81 12.34,29.11 12.34,28.04 11.43,27.13 11.43,21.18 12.65,19.96 12.65,14.17 12.95,13.87 12.95,13.26 13.72,12.5 JP2.27
RC2  (via drill 0.35)
  Top 0.152: JP4.5 47.24,101.96 47.24,104.39 JP4.6 47.4,104.55 43.59,108.36 37.8,108.36 34.44,105 34.44,104.55 JP3.6 | v63.7,30.79 63.25,30.33 58.83,30.33 58.67,30.48 58.67,49.23 61.72,52.27 61.72,83.36 74.37,96.01 78.49,96.01 79.1,95.4 79.86,95.4 80.92,96.47 80.92,98.15 81.53,98.75 81.53,100.43 81.23,100.74 v81.23,104.85
  Bottom 0.152: 81.23,105.46 75.74,105.46 75.59,105.61 72.24,105.61 71.63,106.22 51.51,106.22 50.75,105.46 50.44,105.46 50.29,105.61 48.46,105.61 47.4,104.55 JP4.6 | 81.23,105.46 91.14,105.46 91.75,104.85 R21.2 | v63.7,30.79 64.47,30.02 64.47,28.65 JP1.07 | 81.23,105.46 v81.23,104.85
RC3  (via drill 0.35)
  Top 0.152: JP4.8 49.84,104.39 49.84,101.96 JP4.7 49.84,101.8 v49.84,99.52
  Bottom 0.152: 46.18,105.92 39.17,105.92 37.8,104.55 37.03,104.55 JP3.7 | 46.18,105.92 50.44,105.92 50.6,105.77 51.36,106.53 71.78,106.53 72.39,105.92 76.5,105.92 76.66,105.77 92.2,105.77 92.81,105.16 92.81,104.39 90.37,101.96 90.37,97.23 89.46,96.32 89.46,95.1 92.96,91.59 92.96,91.29 93.73,90.53 R20.2 | v49.84,99.52 49.38,99.52 47.4,97.54 47.4,83.82 36.27,72.69 36.27,71.48 37.03,70.71 37.03,51.36 35.97,50.29 35.97,36.27 29.72,30.02 28.8,30.02 27.74,28.96 27.74,28.19 29.72,26.21 34.59,26.21 35.2,26.82 39.01,26.82 40.39,28.19 40.39,28.96 41.76,30.33 60.5,30.33 61.87,28.96 61.87,28.65 JP1.08 | 46.18,105.92 46.18,103.94 46.79,103.33 47.7,103.33 48.77,104.39 49.68,104.39 JP4.8
RC4
  Top 0.152: JP1.11 54.41,28.65 54.41,29.87 54.56,30.02 56.24,30.02 57.45,31.24 57.45,49.84 60.5,52.88 60.5,54.1 59.59,55.02 59.59,82.14 59.89,82.45 59.89,83.82 71.17,95.1 71.17,101.35 71.32,101.5 71.32,102.26 71.17,102.41 71.17,103.94 71.32,104.09 71.32,104.85 70.26,105.92 62.79,105.92 62.48,105.61 62.48,104.55 JP4.18 62.48,104.39 62.48,101.96 JP4.17 62.48,101.8 61.87,101.8 59.89,99.82 54.56,99.82 54.25,100.13 52.27,100.13 46.79,94.64 42.22,94.64 TEMP.2
  Bottom 0.152: TEMP.2 42.06,94.49 40.84,93.27 38.56,93.27 38.41,93.42 38.41,103.48 39.32,104.39 JP3.8
RC5  (via drill 0.35)
  Top 0.152: JP4.20 65.08,104.39 65.08,101.96 JP4.19 65.08,101.8 65.08,90.37 59.74,85.04 v59.28,85.04 | v59.28,82.75 59.28,52.58 56.84,50.14 56.84,31.55 55.93,30.63 54.25,30.63 52.27,28.65 51.97,28.65 JP1.12
  Bottom 0.152: v59.28,85.04 v59.28,82.75
RC6  (via drill 0.35)
  Top 0.152: JP4.22 67.51,104.39 67.51,101.96 JP4.21 67.67,101.8 65.38,99.52 65.38,90.22 56.84,81.69 v56.39,81.69 | v55.17,80.47 55.47,80.16 55.47,74.52 54.56,73.61 52.43,73.61 51.51,72.69 51.51,71.78 48.62,68.89 48.62,51.51 48.77,51.36 48.77,50.75 48.31,50.29 48.31,29.57 49.23,28.65 JP1.13
  Bottom 0.152: v56.39,81.69 v55.17,80.47
RD0
  Top 0.152: JP1.20 31.55,28.65 31.55,46.94 35.05,50.44 35.05,72.08 LCD1.7
RD1
  Bottom 0.152: JP1.21 29.11,28.65 29.11,28.96 36.27,36.12 36.27,50.14 37.34,51.21 37.34,72.08 LCD1.8
RD2
  Top 0.152: JP1.22 26.52,28.5 26.52,28.19 28.8,25.91 30.48,25.91 32.77,28.19 32.77,28.96 31.85,29.87 31.85,46.79 35.36,50.29 35.36,67.06 39.93,71.63 39.93,72.08 LCD1.9
RD3
  Top 0.152: JP1.23 23.93,28.5 25.3,27.13 27.13,27.13 28.65,25.6 30.63,25.6 32.16,27.13 34.29,27.13 35.36,28.19 35.36,28.96 38.56,32.16 41.45,32.16 42.52,33.22 42.52,50.44 43.43,51.36 43.43,68.73 42.52,69.65 LCD1.10
RD4
  Top 0.152: JP4.24 70.1,104.39 70.1,101.96 JP4.23 70.26,101.8 70.87,101.19 70.87,95.25 56.39,80.77 56.39,72.69 56.54,72.54 56.54,71.63 55.47,70.56 55.02,70.56 53.95,71.63 53.95,72.54 55.78,74.37 55.78,80.77 55.47,81.08 54.86,81.08 47.85,74.07 47.85,73.61 | 47.85,73.61 48.92,72.54 48.92,71.63 48.01,70.71 48.01,51.21 48.16,51.05 47.55,50.44 47.55,49.38 47.7,49.23 47.7,29.57 46.79,28.65 JP1.14 | 47.85,73.61 46.18,73.61 45.11,72.54 45.11,72.24 LCD1.11
RD5  (via drill 0.35)
  Top 0.152: v45.26,24.08 44.81,24.08 43.89,23.16 43.89,21.18 42.67,19.96 42.22,19.96 41.91,19.66 41.91,13.87 42.82,12.95 42.82,12.04 41.76,10.97 37.8,10.97 36.73,12.04 36.73,12.34 JP2.18 | v45.26,27.58 45.26,28.04 45.57,28.35 45.57,29.11 47.4,30.94 47.4,49.07 47.24,49.23 47.24,50.6 47.7,51.05 47.7,72.08 LCD1.12
  Bottom 0.152: v45.26,27.58 v45.26,24.08
RD6
  Top 0.152: JP2.17 39.17,12.5 39.17,17.83 41.91,20.57 42.37,20.57 43.28,21.49 43.28,23.47 48.01,28.19 48.01,28.96 47.85,29.11 47.85,29.26 48.01,29.41 48.01,50.44 48.46,50.9 48.46,51.21 48.31,51.36 48.31,69.04 50.29,71.02 50.29,72.08 LCD1.13
RD7
  Top 0.152: JP2.16 41.76,12.5 41.76,13.56 41.6,13.72 41.6,19.81 42.06,20.27 42.52,20.27 43.59,21.34 43.59,23.32 47.4,27.13 49.53,27.13 50.44,28.04 50.44,29.11 48.62,30.94 48.62,50.14 49.07,50.6 49.07,51.51 48.92,51.66 48.92,68.73 52.27,72.08 52.58,72.08 LCD1.14
RE0
  Top 0.152: JP2.26 16.31,12.5 16.31,26.98 17.68,28.35 17.68,29.11 19.96,31.39 19.96,33.98 30.79,44.81 30.79,50.29 34.44,53.95 34.44,69.19 33.07,70.56 28.5,70.56 27.43,71.63 27.43,72.08 LCD1.4
RE1
  Top 0.152: JP2.25 18.9,12.5 18.9,26.98 20.12,28.19 20.12,28.96 20.27,29.11 20.27,33.83 31.09,44.65 31.09,50.14 34.75,53.8 34.75,69.34 32.46,71.63 32.46,72.08 LCD1.6
RE2
  Bottom 0.152: R1.2 95.71,48.92 75.74,48.92 57.45,30.63 41.6,30.63 41,30.02 37.8,30.02 36.73,28.96 36.73,28.65 JP1.18
RE3
  Bottom 0.152: DS1.9 139.14,77.11 138.38,76.35 138.38,76.05 137.62,75.29 135.33,75.29 130.61,70.56 130.61,62.33 128.63,60.35 128.63,51.66 129.24,51.05 129.24,50.14 138.99,40.39 148.13,40.39 148.59,39.93 150.57,39.93 150.72,39.78 150.72,37.34 148.9,35.51 147.07,35.51 138.84,27.28 108.51,27.28 102.26,21.03 87.02,21.03 86.72,20.73 85.34,20.73 78.64,14.02 75.89,14.02 74.83,12.95 74.83,12.5 JP2.03
RF0  (via drill 0.35)
  Top 0.152: JP4.1 42.22,101.96 42.22,104.39 JP4.2 42.22,104.55 v42.22,106.83 | 135.18,41.91 131.98,38.71 SW3.1 | 139.6,41.91 135.18,41.91 | 139.6,41.91 142.8,38.71 SW4.1 | v144.02,58.98 144.02,45.26 140.66,41.91 139.6,41.91 | 135.18,41.91 127.86,41.91 124.82,38.86 120.85,38.86 SW2.1
  Bottom 0.152: SW1.1 109.88,38.86 113.84,38.86 115.06,40.08 119.48,40.08 120.7,38.86 SW2.1 | v42.22,106.83 42.52,106.53 50.44,106.53 51.05,107.14 72.08,107.14 72.69,106.53 87.63,106.53 87.78,106.38 121.01,106.38 124.05,103.33 124.05,102.87 141.28,85.65 141.28,79.7 141.12,79.55 141.12,63.25 144.02,60.35 v144.02,58.98
RF1  (via drill 0.35)
  Top 0.152: SW8.1 142.8,28.8 140.82,28.8 139.6,30.02 133.2,30.02 131.98,28.8 SW7.1 | JP4.4 44.65,104.39 44.65,101.96 JP4.3 44.65,101.8 38.71,95.86 28.96,95.86 22.1,89 v21.18,89 | v86.41,21.34 79.1,21.34 72.24,28.19 72.24,28.5 JP1.04
  Bottom 0.152: 119.94,27.58 111.25,27.58 109.88,28.96 SW5.1 109.73,28.96 102.11,21.34 v86.41,21.34 | 119.94,27.58 121.01,28.65 SW6.1 | 119.94,27.58 130.76,27.58 131.83,28.65 SW7.1 | 16.46,28.35 18.9,25.91 27.74,25.91 28.96,24.69 35.36,24.69 35.97,25.3 41.91,25.3 44.5,22.71 57.15,22.71 60.35,25.91 70.87,25.91 71.17,25.6 72.39,25.6 73.91,27.13 74.83,27.13 75.89,28.19 75.89,28.96 74.83,30.02 73.3,30.02 72.24,28.96 72.24,28.65 JP1.04 | 16.46,28.35 16.31,28.5 JP1.26 16.46,28.35 | v21.18,89 21.49,88.7 21.49,86.26 18.14,82.91 18.14,68.58 17.07,67.51 17.07,28.96 16.46,28.35
RF2
  Top 0.152: SW12.1 142.49,18.75 141.28,17.53 137.31,17.53 136.09,18.75 132.13,18.75 SW11.1 131.98,18.75 130.76,17.53 126.34,17.53 124.97,18.9 121.16,18.9 SW10.1 121.01,18.9 119.94,17.83 115.06,17.83 113.84,19.05 109.88,19.05 SW9.1
  Bottom 0.152: JP1.27 13.87,28.5 13.87,19.05 20.12,12.8 20.12,12.04 21.18,10.97 21.49,10.97 22.71,12.19 22.71,12.95 24.38,14.63 30.94,14.63 32.77,12.8 32.77,12.04 32.61,11.89 32.61,11.12 32.77,10.97 32.92,10.97 39.78,4.12 94.79,4.12 109.73,19.05 SW9.1
RF3
  Top 0.152: SW16.1 142.8,9.6 141.43,10.97 133.2,10.97 131.98,9.75 SW15.1 | SW14.1 121.01,9.6 118.57,12.04 115.98,12.04 115.82,12.19 112.17,12.19 109.73,9.75 SW13.1 109.58,9.6 99.36,9.6 98.75,10.21 97.84,10.21 92.96,5.33 57,5.33 56.84,5.49 46.18,5.49 46.02,5.33 34.29,5.33 33.68,5.94 33.38,5.94 32.61,6.71 32.61,10.67 32.31,10.97 13.56,10.97 12.5,12.04 12.5,12.95 12.65,13.11 12.65,13.72 12.34,14.02 12.34,19.81 11.12,21.03 11.12,27.28 11.28,27.43 11.28,28.5 JP1.28
  Bottom 0.152: SW15.1 131.83,9.6 130.76,8.53 127.86,8.53 127.56,8.23 122.53,8.23 121.16,9.6 SW14.1
RF4  (via drill 0.35)
  Top 0.152: v96.93,51.97 97.38,51.97 98.15,51.21 99.82,51.21 99.97,51.05 104.24,51.05 116.13,39.17 116.13,38.86 SW1.2 116.28,38.71 116.28,36.88 117.65,35.51 117.65,30.18 116.43,28.96 | 116.43,28.96 116.43,26.82 117.65,25.6 117.65,20.42 116.43,19.2 SW9.2 116.28,19.2 114.91,20.57 108.66,20.57 99.21,11.12 97.38,11.12 92.51,6.25 57.45,6.25 57.3,6.4 45.72,6.4 45.57,6.25 34.75,6.25 34.14,6.86 33.83,6.86 33.53,7.16 33.53,11.28 32.92,11.89 32.92,12.65 31.55,14.02 25.15,14.02 23.93,12.8 23.93,12.5 JP2.23 | 116.43,28.96 SW5.2
  Bottom 0.152: v96.93,51.97 97.23,52.27 97.23,63.4 100.58,66.75 100.58,72.08 98.6,74.07 98.6,88.09 99.82,89.31 100.28,89.31 101.04,90.07 101.04,97.84 99.97,98.91 99.97,99.36 98.45,100.89 98.45,104.7 R24.2 | SW13.2 116.28,9.75 116.28,12.04 117.65,13.41 117.65,17.83 116.43,19.05 SW9.2
RF5  (via drill 0.35)
  Top 0.152: v103.17,63.55 102.56,64.16 101.96,64.16 101.65,63.86 95.56,63.86 94.03,65.38 94.03,76.81 92.35,78.49 92.35,83.06 92.2,83.21 92.2,86.56 90.68,88.09 R25.2 | SW10.2 127.71,19.05 128.93,20.27 128.93,25.45 127.71,26.67 127.71,28.65 SW6.2 127.71,28.8 128.63,29.72 128.63,35.51 127.41,36.73 127.41,38.71 SW2.2 | JP2.22 26.52,12.34 27.43,12.34 28.5,11.28 32.46,11.28 32.92,10.82 32.92,6.86 33.53,6.25 33.83,6.25 34.44,5.64 45.87,5.64 46.02,5.79 57,5.79 57.15,5.64 92.81,5.64 97.69,10.52 98.91,10.52 99.52,9.91 107.14,9.91 108.36,11.12 110.64,11.12 112.01,12.5 115.98,12.5 116.13,12.34 118.72,12.34 120.09,10.97 126.34,10.97 127.56,9.75 SW14.2
  Bottom 0.152: v103.17,63.55 103.17,63.09 108.2,58.06 114.3,58.06 125.73,46.63 125.73,40.39 127.25,38.86 SW2.2 | SW14.2 127.71,9.75 127.71,12.04 128.93,13.26 128.93,17.68 127.71,18.9 SW10.2
RF6  (via drill 0.35)
  Top 0.152: v102.26,81.53 102.26,83.21 101.65,83.82 101.65,84.28 97.99,87.94 97.23,87.94 R26.2 | SW7.2 138.53,28.65 138.53,26.67 139.75,25.45 139.75,20.12 138.53,18.9 SW11.2
  Bottom 0.152: v102.26,81.53 102.72,81.53 113.23,71.02 113.23,70.1 119.94,63.4 119.94,60.2 120.85,59.28 120.85,58.22 124.36,54.71 124.66,54.71 128.63,50.75 128.63,49.84 138.53,39.93 138.53,38.71 SW3.2 138.53,38.56 139.75,37.34 139.75,32.92 138.53,31.7 138.53,28.8 SW7.2 | SW11.2 138.38,18.75 137.16,17.53 137.16,13.11 138.38,11.89 138.38,9.75 SW15.2 138.38,9.6 137.01,8.23 128.02,8.23 127.71,7.92 122.38,7.92 122.07,8.23 99.36,8.23 94.94,3.81 39.62,3.81 32.77,10.67 30.48,10.67 29.11,12.04 29.11,12.34 JP2.21
RF7
  Top 0.152: 147.83,13.11 149.2,11.73 149.2,9.6 SW16.2 | 147.83,13.11 147.83,17.53 149.05,18.75 SW12.2 149.05,18.9 147.98,19.96 147.98,25.45 149.35,26.82 149.35,28.65 SW8.2 149.5,28.8 150.72,30.02 150.72,35.36 149.5,36.58 149.5,38.56 SW4.2 | 147.83,13.11 146,11.28 120.24,11.28 118.87,12.65 116.28,12.65 116.13,12.8 111.86,12.8 110.49,11.43 108.2,11.43 106.98,10.21 99.67,10.21 99.06,10.82 97.54,10.82 92.66,5.94 57.3,5.94 57.15,6.1 45.87,6.1 45.72,5.94 34.59,5.94 33.98,6.55 33.68,6.55 33.22,7.01 33.22,11.12 32.77,11.58 32.31,11.58 31.55,12.34 JP2.20
  Bottom 0.152: R27.2 101.04,87.94 101.04,84.73 102.26,83.52 102.26,82.45 113.54,71.17 113.54,70.26 120.24,63.55 120.24,60.35 121.16,59.44 121.16,58.37 124.51,55.02 124.82,55.02 128.93,50.9 128.93,49.99 138.84,40.08 147.98,40.08 149.35,38.71 SW4.2
RFD
  Bottom 0.152: JP1.25 18.9,28.5 18.9,26.82 19.2,26.52 28.04,26.52 29.26,25.3 35.05,25.3 35.66,25.91 42.22,25.91 44.81,23.32 56.84,23.32 60.05,26.52 70.87,26.52 71.32,26.98 73.3,26.98 74.83,28.5 JP1.03
VBUS  (via drill 0.35)
  Top 0.152: R13.1 17.53,85.8 18.59,86.87 21.34,86.87 21.49,87.02 25.76,87.02 26.82,85.95 R14.1 26.98,85.8 26.98,81.99 24.38,79.4 24.38,74.68 22.25,72.54 22.25,72.24 LCD1.2 | v71.63,26.36 73.61,26.36 79.7,20.27 79.7,12.5 JP2.01
  Bottom 0.152: v71.63,26.36 71.17,26.36 71.02,26.21 60.2,26.21 57,23.01 44.65,23.01 42.06,25.6 35.81,25.6 35.2,24.99 29.11,24.99 27.89,26.21 19.05,26.21 17.83,27.43 17.83,27.89 17.53,28.19 17.53,28.96 17.37,29.11 17.37,67.36 22.1,72.08 LCD1.2
VO
  Top 0.152: R14.2 29.41,88.39 29.41,83.97 24.69,79.25 24.69,72.24 LCD1.3
VTG
  Top 0.152: JP4.25 72.69,101.96 72.69,104.39 JP4.26 | R26.1 97.23,82.3 100.89,82.3 R27.1
  Bottom 0.152: TEMP.1 42.22,92.05 43.13,92.96 43.43,92.96 46.79,96.32 46.79,97.38 50.9,101.5 50.9,105.16 51.66,105.92 71.48,105.92 72.54,104.85 72.54,104.55 JP4.26 72.69,104.39 73.76,104.39 74.83,103.33 75.89,103.33 78.49,100.74 78.94,100.74 79.55,100.13 79.86,100.13 80.92,99.06 80.92,97.54 81.53,96.93 81.53,88.39 86.26,83.67 87.02,83.67 IC1.10 87.17,83.67 88.24,82.6 90.53,82.6 R25.1 90.68,82.45 96.93,82.45 97.08,82.3 R26.1 97.23,82.3 98.3,83.36 98.3,88.24 98.45,88.39 98.45,99.06 R24.1 | JP2.06 67.21,12.34 67.21,12.04 68.28,10.97 69.8,10.97 71.02,12.19 71.02,12.95 72.08,14.02 75.44,14.02 75.74,14.33 78.49,14.33 94.49,30.33 94.49,45.26 97.08,47.85 97.08,51.21 97.54,51.66 97.54,63.25 100.89,66.6 100.89,72.24 98.91,74.22 98.91,80.31 100.89,82.3 R27.1